# EAGLE design MPU6050-IMU(I2C_V2) (EAGLE 6.5.0)
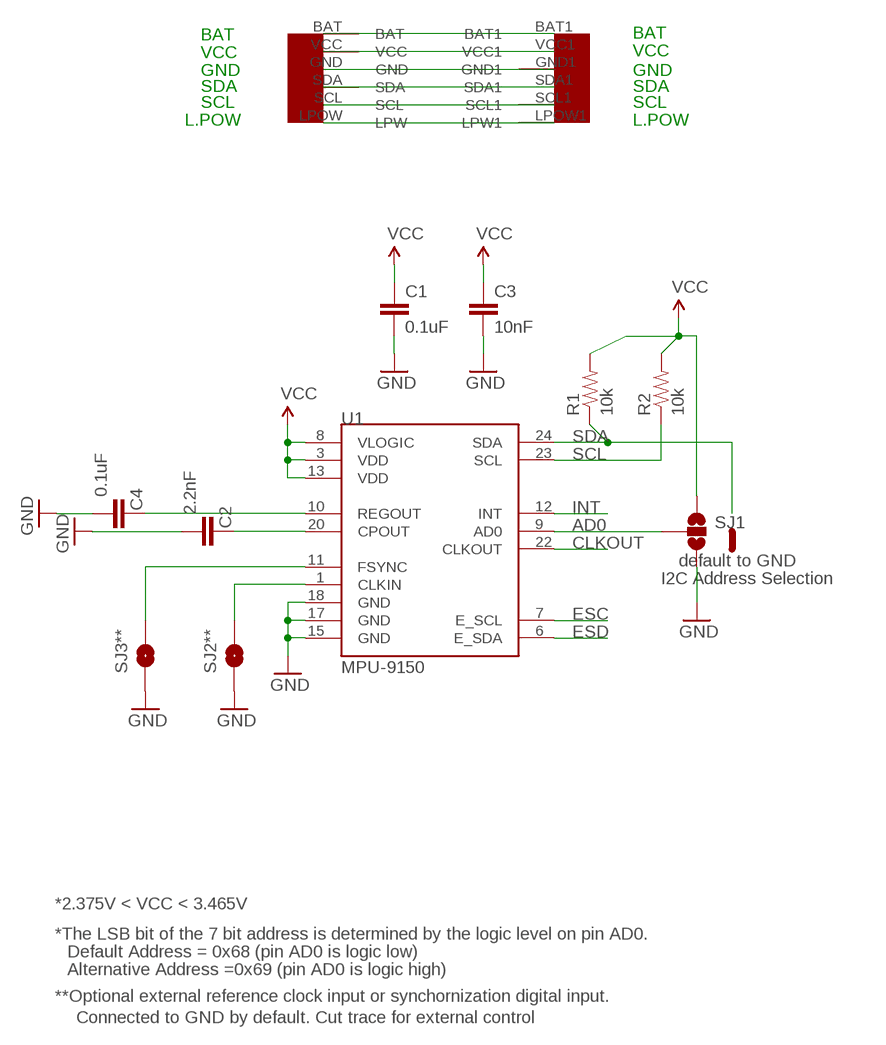
[diagram p0: schematic, sheet 1]

## Parts
C1  0.1uF  CAP0402-CAP  [0402-CAP]
C2  2.2nF  CAP0402-CAP  [0402-CAP]
C3  10nF  CAP0402-CAP  [0402-CAP]
C4  0.1uF  CAP0402-CAP  [0402-CAP]
R1  10k  RESISTOR0402-RES  [0402-RES]
R2  10k  RESISTOR0402-RES  [0402-RES]
SJ1  SOLDERJUMPER_2WAYPASTE2&3  [SJ_3_PASTE2&3]
SJ2**  SOLDERJUMPERTRACE  [SJ_2S-TRACE]
SJ3**  SOLDERJUMPERTRACE  [SJ_2S-TRACE]
U1  MPU-9150  MPU-9150QFN-24-NP  [QFN-24-NP]
U$1  EZ-I2CHEADERV1  [EZ-I2CHEADERV1]

## Nets
AD0: SJ1.2 U1.9(AD0)
BAT: U$1.BAT U$1.BAT1
CLKIN: SJ2**.2 U1.1(CLKIN)
CLKOUT: U1.22(CLKOUT)
ESC: U1.7(E_SCL)
ESD: U1.6(E_SDA)
FSYNC: SJ3**.2 U1.11(FSYNC)
GND: C1.2 C2.2 C3.2 C4.2 SJ1.3 SJ2**.1 SJ3**.1 U1.15(GND) U1.17(GND) U1.18(GND) U$1.GND U$1.GND1
INT: U1.12(INT)
N$1: C2.1 U1.20(CPOUT)
N$2: C4.1 U1.10(REGOUT)
N$6: U$1.LPOW1(LPW1) U$1.LPOW(LPW)
SCL: R2.1 U1.23(SCL) U$1.SCL U$1.SCL1
SDA: R1.1 U1.24(SDA) U$1.SDA U$1.SDA1
VCC: C1.1 C3.1 R1.2 R2.2 SJ1.1 U1.3(VDD) U1.8(VLOGIC) U1.13(VDD) U$1.VCC U$1.VCC1

## Notes on the sheet
- BAT | BAT
- VCC | VCC
- GND | GND
- SDA | SDA
- SCL | SCL
- L.POW | L.POW
- default to GND
- I2C Address Selection
- *2.375V < VCC < 3.465V
- *The LSB bit of the 7 bit address is determined by the logic level on pin AD0.
- Default Address = 0x68 (pin AD0 is logic low)
- Alternative Address =0x69 (pin AD0 is logic high)
- **Optional external reference clock input or synchornization digital input.
- Connected to GND by default. Cut trace for external control

## Library data of the parts
C1 C4 = SparkFun-Passives:CAP: Capacitor Standard 0603 ceramic capacitor, and 0.1" leaded capacitor.; MF: AVX; MPN: 02016D104KAT2A; OC_FARNELL: 1657913RL
C2 = SparkFun-Passives:CAP: Capacitor Standard 0603 ceramic capacitor, and 0.1" leaded capacitor.; MF: AVX; MPN: 06035C222KAT2A; OC_FARNELL: 498592
C3 = SparkFun-Passives:CAP: Capacitor Standard 0603 ceramic capacitor, and 0.1" leaded capacitor.; MF: AVX; MPN: 06035G103ZAT2A; OC_FARNELL: 317433
R1 R2 = SparkFun-Passives:RESISTOR: Resistor Basic schematic elements and footprints for 0603, 1206, and PTH resistors.; OC_FARNELL: unknown
SJ1 = SparkFun-Passives:SOLDERJUMPER_2WAY: Solder Jumper 2 way solder jumper; OC_FARNELL: unknown
SJ2** SJ3** = SparkFun-Passives:SOLDERJUMPER: Solder Jumper Standard SMD solder jumper. Used to automate production. Two varients : Normally Open and Normally Closed are the same, but have different paste layers. NC will have a large amount of paste and should jumper during reflow.; OC_FARNELL: unknown
U1 = SparkFun-Sensors:MPU-9150: 9DOF (3mag, 3accel, 3rotat). I2C interface.; OC_FARNELL: unknown
U$1 = UniqueInteractionsLib:EZ-I2CHEADERV1

## Board
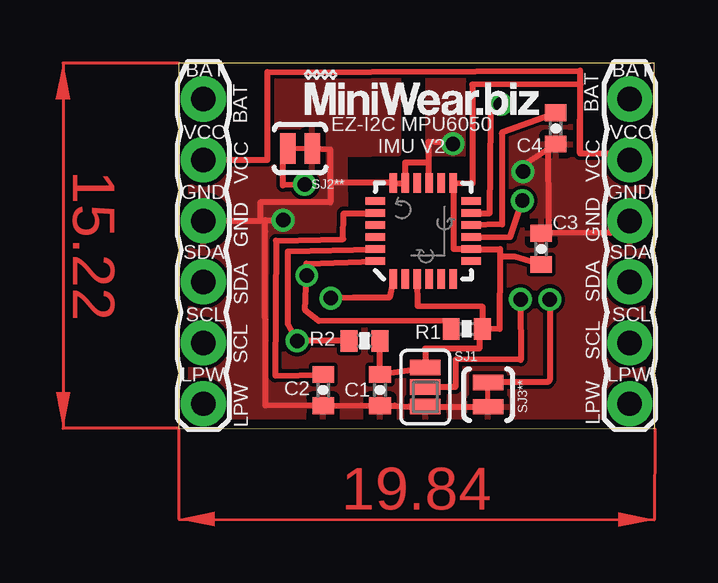
[diagram p1: board, top side]
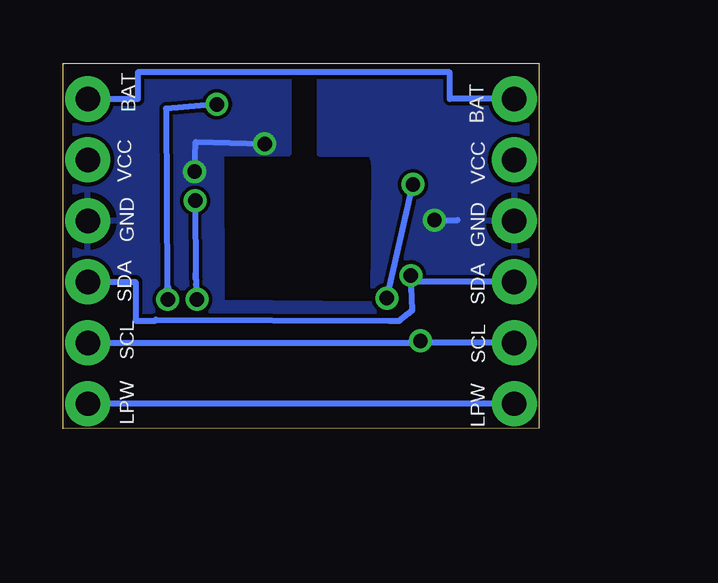
[diagram p2: board, bottom side, seen from below]

Size 19.84 x 15.23 mm. Coordinates in mm from the lower left corner, seen from the top.
Outline: 0,0.02 19.84,0 19.84,15.23 0,15.23 0,0.02
Copper layers (1*16): Top 0.0356mm / dielectric 1.5011mm / Bottom 0.0356mm
Design rules "oshParkPCBDesignRules": minimum track width 6mil, minimum drill 13mil, track to track 6mil, track to pad 6mil, pad to pad 6mil, via to via 6mil, smd to smd 6mil, copper to edge 15mil, drill to drill 6mil, minimum pad ring 7mil, minimum via ring 7mil, stop-mask expansion 3mil, vias tented up to drill 0mil, thermal gap 10mil

### Footprints (pad centres in the part's own frame; a part is rotated, then mirrored left to right if it is on the bottom)
0402-CAP = smd 0.7 x 0.9: 1 -0.65,0; 2 0.65,0
0402-RES = smd 0.7 x 0.9: 1 -0.65,0; 2 0.65,0
SJ_3_PASTE2&3 = smd 0.635 x 1.27: 1 -0.813,0; 2 0,0; 3 0.813,0
SJ_2S-TRACE = smd 0.635 x 1.27: 1 -0.508,0; 2 0.508,0
QFN-24-NP = smd 0.8 x 0.3: 1 -2,1.25; 2 -2,0.75; 3 -2,0.25; 4 -2,-0.25; 5 -2,-0.75; 6 -2,-1.25; 13 2,-1.25; 14 2,-0.75; 15 2,-0.25; 16 2,0.25; 17 2,0.75; 18 2,1.25 | smd 0.3 x 0.8: 7 -1.25,-2; 8 -0.75,-2; 9 -0.25,-2; 10 0.25,-2; 11 0.75,-2; 12 1.25,-2; 19 1.25,2; 20 0.75,2; 21 0.25,2; 22 -0.25,2; 23 -0.75,2; 24 -1.25,2
EZ-I2CHEADERV1 = drill 1.016 pad 1.88: BAT 0,-1.27; BAT1 17.78,-1.27; GND 0,-6.35; GND1 17.78,-6.35; LPOW 0,-13.97; LPOW1 17.78,-13.97; SCL 0,-11.43; SCL1 17.78,-11.43; SDA 0,-8.89; SDA1 17.78,-8.89; VCC 0,-3.81; VCC1 17.78,-3.81

### Placement (x,y rotation side)
C1  8.4,1.61 270 top
C2  6.03,1.61 270 top
C3  15.12,7.49 90 top
C4  15.72,12.51 270 top
R1  12.01,4.16 0 top
R2  7.75,3.66 0 top
SJ1  10.29,1.74 270 top
SJ2**  5.06,11.67 180 top
SJ3**  12.9,1.42 90 top
U1  10.2,8.24 90 top
U$1  1.03,15.01 0 top
U$2  [LOGO2]  5.15,12.89 0 top

### Tracks (layer width: path | path; a pad name or v marks a point on that pad's centre or on a via)
AD0  (via drill 0.6 pad 0.25)
  Top 0.254: U1.9 13.83,7.99 v14.33,9.5 | v14.26,5.39 14.26,2.87 11.55,2.89 11.54,1.74 SJ1.2
  Bottom 0.254: v14.33,9.5 14.33,6.26 14.33,6.47 14.31,6 v14.26,5.39
BAT
  Bottom 0.254: U$1.BAT 3.72,13.74 3.72,14.84 16.73,14.84 16.73,13.74 18.6,13.74 U$1.BAT1
CLKIN  (via drill 0.6 pad 0.25)
  Top 0.254: U1.1 8.79,5.46 8.12,5.46 7.29,5.46 v6.34,5.44 | v5.26,10.18 4.35,10.14 4.35,11.78 SJ2**.2
  Bottom 0.254: v6.34,5.44 v5.26,10.18
FSYNC  (via drill 0.6 pad 0.25)
  Top 0.254: U1.11 12.97,8.99 13.01,12.88 13.01,13.56 v13.43,13.52 | v15.48,5.38 15.47,2.04 15.39,1.94 SJ3**.2
  Bottom 0.254: v13.43,13.52 15.55,13.33 15.51,5.84 15.46,5.89 v15.48,5.38
GND  (via drill 0.6)
  Top 0.254: SJ3**.1 SJ1.3 9.61,0.92 9.01,0.96 C1.2 7.64,0.97 C2.2 3.62,0.97 3.61,8.22 3.61,8.69 v4.36,8.69 3.4,8.69 | 6.33,10.24 U1.18 U1.17 9.45,11.1 10.41,11.1 | 6.33,10.24 6.33,11.63 SJ2**.1 | 10.41,11.1 10.41,10.24 U1.15 | v14.36,10.71 14.36,10.95 C4.2 15.42,11.86 15.44,8.69 15.44,8.14 C3.2 18,8.16 18,8.66 U$1.GND1 | v11.44,11.87 10.41,11.95 10.41,11.1 | 6.33,10.24 6.33,9.44 3.4,9.44 3.4,8.69 | U$1.GND 3.4,8.66 3.4,8.69
  Bottom 0.254: v14.36,10.71 14.32,11.95 v11.44,11.87 | v4.36,8.69 3.4,8.69
  pour Top: 19.31,0.04 -0.43,0.07 -0.4,15.32 9.15,15.28 9.15,11.46 6.92,11.42 6.95,5.18 13.26,5.23 13.21,11.45 10.42,11.46 10.42,15.28 19.44,15.43
  pour Bottom: 19.31,0.04 -0.41,0.05 -0.42,15.25 9.15,15.28 9.15,11.46 7.03,11.44 6.93,11.23 6.89,11.01 6.93,5.19 13.22,5.24 13.24,11.47 10.42,11.48 10.42,15.28 19.45,15.41
N$1
  Top 0.254: C2.1 4.02,2.22 4.06,7.84 6.86,7.9 6.88,8.97 7.21,8.97 U1.20
N$2
  Top 0.254: U1.10 13.49,8.51 13.48,12.25 13.52,12.37 C4.1
N$6
  Bottom 0.254: U$1.LPOW U$1.LPOW1
SCL  (via drill 0.6)
  Top 0.254: U1.23 4.56,7.39 4.55,4.35 v4.94,3.66 R2.1
  Bottom 0.254: U$1.SCL 4.94,3.58 | U$1.SCL1 4.94,3.58 | 4.94,3.58 v4.94,3.66
SDA  (via drill 0.6)
  Top 0.254: U1.24 5.33,6.88 v5.34,6.38 5.28,4.93 5.84,4.5 11.41,4.47 R1.1
  Bottom 0.254: U$1.SDA 5.34,6.12 v5.34,6.38 5.28,4.93 5.43,4.81 5.84,4.5 6.24,4.5 15.97,4.55 15.97,4.51 16.82,4.51 16.82,6.12 U$1.SDA1
VCC
  Top 0.254: R2.2 C1.1 SJ1.1 10.29,3.33 12.53,3.33 12.53,4.04 R1.2 | R1.2 12.68,4.37 12.68,5.08 9.97,5.1 U1.3 | 13.4,7.17 13.4,7.49 U1.8 11.46,7.49 U1.13 12.26,10.22 12.24,14.35 16.76,14.34 16.73,11.47 | 13.4,7.17 13.38,4.15 R1.2 | C3.1 14.01,7.17 13.4,7.17 | 16.73,11.47 16.73,14.92 3.71,14.86 3.71,11.2 U$1.VCC | 16.73,11.47 18.04,11.47 18.04,11.2 U$1.VCC1
(copper drawn outside any net)
  shapes: Top area x2

### Text on the board
tNames: EZ-I2C MPU6050 / IMU V2